# EasyEDA Pro project TTMT_ENTIRE_EASYEDA_PROJECT.epro, board PCB6
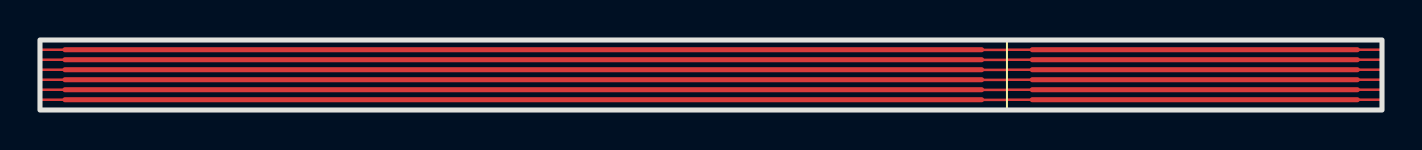
[diagram p8: board, top side]
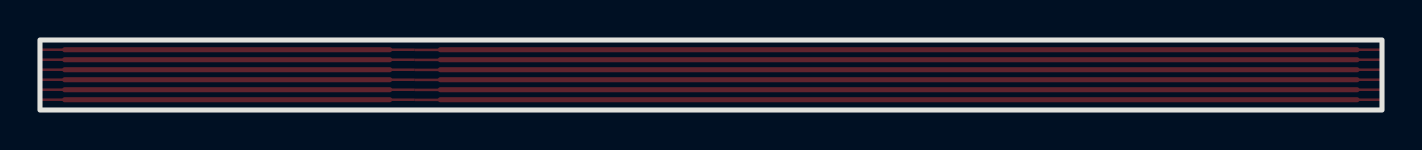
[diagram p9: board, bottom side, seen from below]

Outline 67.12 x 3.5 mm; copper layers: Top Layer, Bottom Layer. Coordinates in mm from the lower left corner of the outline.
Outline path: rectangle 0,3.5 67.12,0
Stack: Top Layer 0.012mm / Dielectric1 0.025mm FR4 er 4.5 / Bottom Layer 0.012mm

## Design rules (mm)
template: Custom Config
spacing copperThickness1oz (default): track to track 0.102, other pairs 0 to 0.3
spacing copperThickness2oz: track to track 0.203, other pairs 0.152 to 0.3
track width copperThickness1oz (default): min 0.127, default 0.254, max 2.54
track width copperThickness2oz: min 0.203, default 0.254, max 2.54
differential pair differentialPair (default): width min 0.127, default 0.254, max 2.54; gap min 0.152, default 0.152
via viaSize (default): diameter min 0.5, default 0.61, max 10; hole min 0.3, default 0.305, max 6.3

## Placement (name value [footprint] x y rotation side)
U1  -  [6pinpadtopffc]  0 0.45 0 top
U1#2  -  [6pinpadtopffc]  48.38 0.45 0 top
U2  -  [6pinpadtopffc]  64.62 0.45 0 top
U2#2  -  [6pinpadtopffc]  45.88 0.44 0 top

## Footprints (pads in the part's own frame, mm; a bottom-side part is the same pattern mirrored in y, then rotated)
6pinpadtopffc
  custom 2.5x0.127 smd: 1(1.25,0.064) 2(1.25,0.564) 3(1.25,1.063) 4(1.25,1.563) 5(1.25,2.063) 6(1.25,2.563)

## Nets
$1N163: U1.1 U1#2.1 U2.1 U2#2.1
$1N165: U1.2 U1#2.2 U2.2 U2#2.2
$1N167: U1.3 U1#2.3 U2.3 U2#2.3
$1N169: U1.4 U1#2.4 U2.4 U2#2.4
$1N171: U1.5 U1#2.5 U2.5 U2#2.5
$1N173: U1.6 U1#2.6 U2.6 U2#2.6

## Routing (per net, layer and track width the routed paths; a pad name or vN(x,y) marks a point on that pad's centre or on a via; arc(x,y) is an arc through that point)
$1N163: length 62.1
  Top Layer w0.254: U1.1 47.1,0.51 ; U1#2.1 65.89,0.51
$1N165: length 62.1
  Top Layer w0.254: U1.2 47.1,1.01 ; 65.89,1.01 U1#2.2
$1N167: length 62.1
  Top Layer w0.254: U1#2.3 65.89,1.51 ; 47.1,1.51 U1.3
$1N169: length 62.1
  Top Layer w0.254: U1.4 47.1,2.01 ; 65.89,2.01 U1#2.4
$1N171: length 62.1
  Top Layer w0.254: 47.1,2.51 U1.5 ; U1#2.5 65.89,2.51
$1N173: length 62.1
  Top Layer w0.254: 65.89,3.01 U1#2.6 ; U1.6 47.1,3.01
